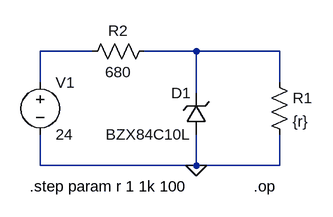
[diagram p0: schematic 2-vr-vin.asc]
2-vr-vin.asc, the LTspice schematic file:
Version 4.1
SHEET 1 880 680
WIRE 128 80 48 80
WIRE 288 80 208 80
WIRE 416 80 288 80
WIRE 48 128 48 80
WIRE 416 128 416 80
WIRE 288 144 288 80
WIRE 48 256 48 208
WIRE 288 256 288 208
WIRE 288 256 48 256
WIRE 416 256 416 208
WIRE 416 256 288 256
FLAG 288 256 0
SYMBOL voltage 48 112 R0
WINDOW 123 0 0 Left 0
WINDOW 39 0 0 Left 0
SYMATTR InstName V1
SYMATTR Value 24
SYMBOL zener 304 208 R180
WINDOW 0 24 64 Left 2
WINDOW 3 24 0 Left 2
SYMATTR InstName D1
SYMATTR Value BZX84C10L
SYMBOL res 400 112 R0
SYMATTR InstName R1
SYMATTR Value {r}
SYMBOL res 224 64 R90
WINDOW 0 0 56 VBottom 2
WINDOW 3 32 56 VTop 2
SYMATTR InstName R2
SYMATTR Value 680
TEXT 32 288 Left 2 !.step param r 1 1k 100
TEXT 376 288 Left 2 !.op

The netlist it stands for:
* 2-vr-vin.asc
V1 N001 0 24
D1 0 N002 BZX84C10L
R1 N002 0 {r}
R2 N002 N001 680
.model D D
.lib standard.dio
.step param r 1 1k 100
.op
.backanno
.end